# Altium schematic sheet main.SchDoc
size A4; Organization: Altium Limited; Address1: L3, 12a Rodborough Rd; Address2: Frenchs Forest; Address3: NSW; Address4: Australia 2086
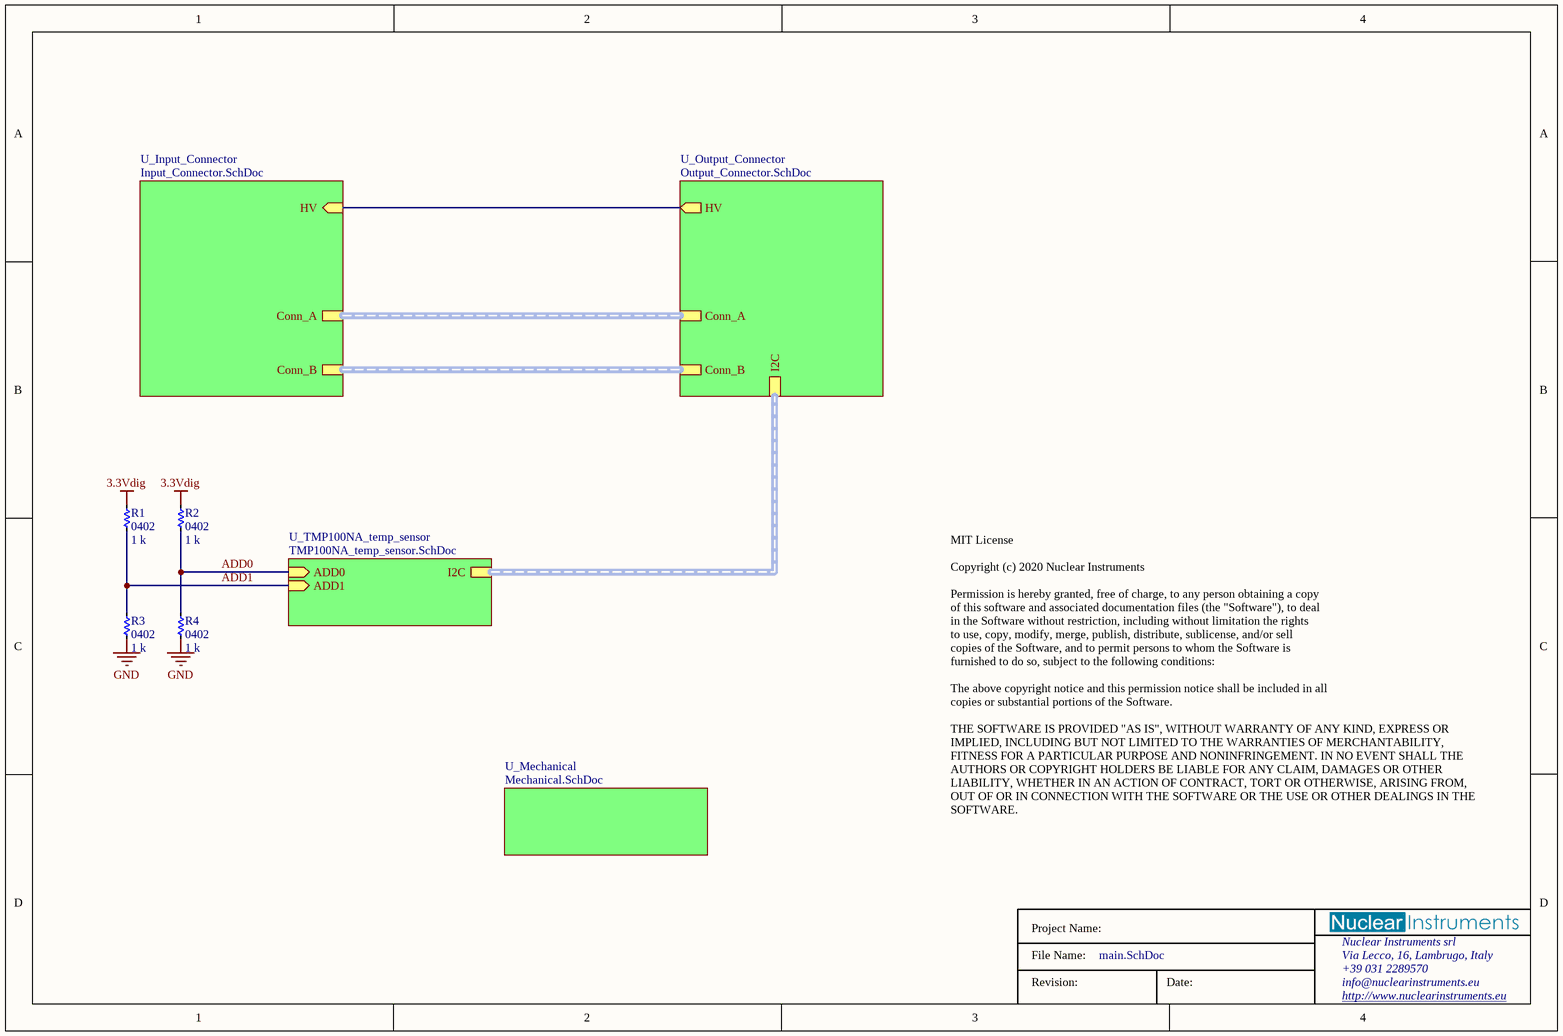
[diagram p0: main.SchDoc]

## Parts
R1  0402  value 1 k  [RESSMD0402]
R2  0402  value 1 k  [RESSMD0402]
R3  0402  value 1 k  [RESSMD0402]
R4  0402  value 1 k  [RESSMD0402]

## Sub-sheets
U_Input_Connector = Input_Connector.SchDoc: Conn_B (harness 32sig_B), Conn_A (harness 32sig_A), HV (in)
U_Mechanical = Mechanical.SchDoc: no entries
U_Output_Connector = Output_Connector.SchDoc: Conn_B (harness 32sig_B), Conn_A (harness 32sig_A), I2C (harness I2C), HV (out)
U_TMP100NA_temp_sensor = TMP100NA_temp_sensor.SchDoc: ADD0 (in), ADD1 (in), I2C (harness I2C)

## Nets
3.3Vdig: R1.1 R2.1
GND: R3.2 R4.2
ADD0: R2.2 R4.1 ; sheet U_TMP100NA_temp_sensor/ADD0
ADD1: R1.2 R3.1 ; sheet U_TMP100NA_temp_sensor/ADD1
(unnamed): sheet U_Output_Connector/HV, sheet U_Input_Connector/HV

## Buses and harness runs
harness sheet U_Input_Connector/Conn_A = sheet U_Output_Connector/Conn_A
harness sheet U_Input_Connector/Conn_B = sheet U_Output_Connector/Conn_B
harness sheet U_Output_Connector/I2C = sheet U_TMP100NA_temp_sensor/I2C

## Notes on the sheet
- MIT License
  Copyright (c) 2020 Nuclear Instruments
  Permission is hereby granted, free of charge, to any person obtaining a copy
  of this software and associated documentation files (the "Software"), to deal
  in the Software without restriction, including without limitation the rights
  to use, copy, modify, merge, publish, distribute, sublicense, and/or sell
  copies of the Software, and to permit persons to whom the Software is
  furnished to do so, subject to the following conditions:
  The above copyright notice and this permission notice shall be included in all
  copies or substantial portions of the Software.
  THE SOFTWARE IS PROVIDED "AS IS", WITHOUT WARRANTY OF ANY KIND, EXPRESS OR
  IMPLIED, INCLUDING BUT NOT LIMITED TO THE WARRANTIES OF MERCHANTABILITY,
  FITNESS FOR A PARTICULAR PURPOSE AND NONINFRINGEMENT. IN NO EVENT SHALL THE
  AUTHORS OR COPYRIGHT HOLDERS BE LIABLE FOR ANY CLAIM, DAMAGES OR OTHER
  LIABILITY, WHETHER IN AN ACTION OF CONTRACT, TORT OR OTHERWISE, ARISING FROM,
  OUT OF OR IN CONNECTION WITH THE SOFTWARE OR THE USE OR OTHER DEALINGS IN THE
  SOFTWARE.
- Project Name:
- Revision:
- File Name:
- Date:
- Nuclear Instruments srl
- Via Lecco, 16, Lambrugo, Italy
- +39 031 2289570
- info@nuclearinstruments.eu
- http://www.nuclearinstruments.eu

## Library data of the parts
R1-R4 = RES0402-1k